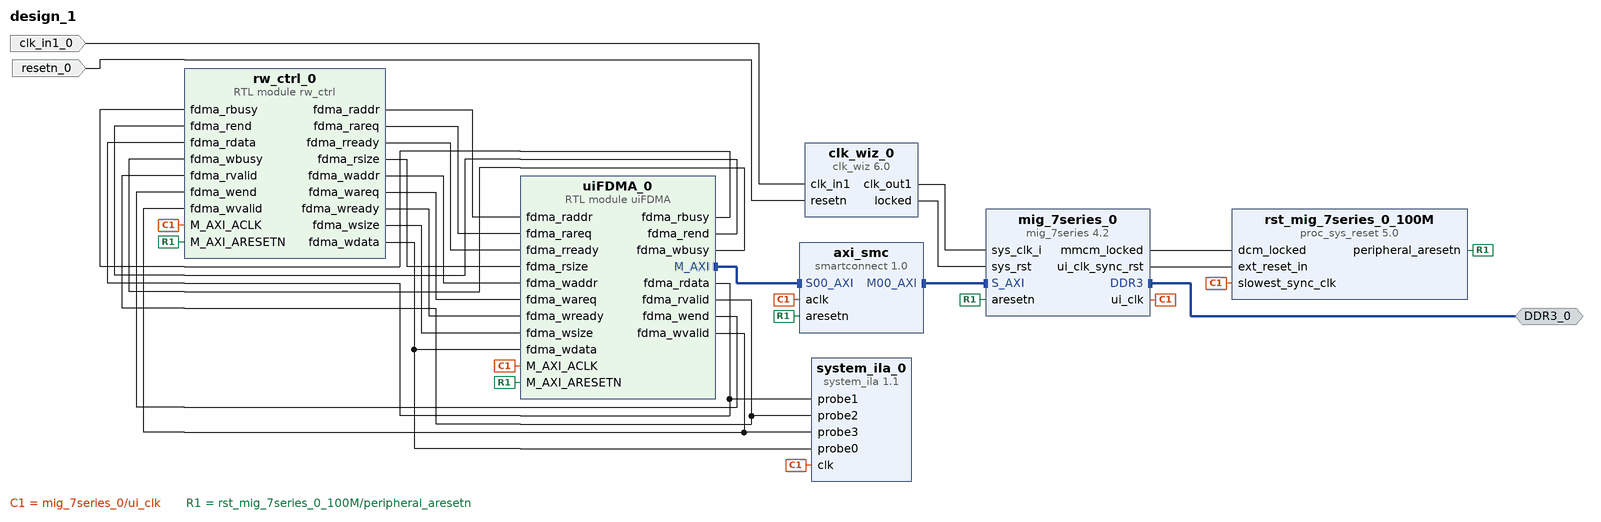
[diagram p0: block diagram of the top level]
# Vivado block design design_1, xc7a35tfgg484-1, Vivado 2021.2
create_bd_design design_1

create_bd_intf_port -mode Master -vlnv xilinx.com:interface:ddrx_rtl:1.0 DDR3_0
create_bd_port -dir I -type rst resetn_0
create_bd_port -dir I -type clk clk_in1_0
set_property -dict {CONFIG.FREQ_HZ 50000000} [get_bd_ports clk_in1_0]

create_bd_cell -type ip -vlnv xilinx.com:ip:mig_7series:4.2 mig_7series_0
set_property -dict [list \
  CONFIG.BOARD_MIG_PARAM Custom \
  CONFIG.MIG_DONT_TOUCH_PARAM Custom \
  CONFIG.RESET_BOARD_INTERFACE Custom \
  CONFIG.XML_INPUT_FILE mig_a.prj \
] [get_bd_cells mig_7series_0]
create_bd_cell -type ip -vlnv xilinx.com:ip:clk_wiz:6.0 clk_wiz_0
set_property -dict [list \
  CONFIG.CLKIN1_JITTER_PS 200.0 \
  CONFIG.CLKOUT1_JITTER 142.107 \
  CONFIG.CLKOUT1_PHASE_ERROR 164.985 \
  CONFIG.CLKOUT1_REQUESTED_OUT_FREQ 200.000 \
  CONFIG.MMCM_CLKFBOUT_MULT_F 20.000 \
  CONFIG.MMCM_CLKIN1_PERIOD 20.000 \
  CONFIG.MMCM_CLKIN2_PERIOD 10.0 \
  CONFIG.MMCM_CLKOUT0_DIVIDE_F 5.000 \
  CONFIG.PRIM_IN_FREQ 50.000 \
  CONFIG.RESET_PORT resetn \
  CONFIG.RESET_TYPE ACTIVE_LOW \
] [get_bd_cells clk_wiz_0]
create_bd_cell -type ip -vlnv xilinx.com:ip:smartconnect:1.0 axi_smc
set_property -dict {CONFIG.NUM_SI 1} [get_bd_cells axi_smc]
create_bd_cell -type ip -vlnv xilinx.com:ip:proc_sys_reset:5.0 rst_mig_7series_0_100M
create_bd_cell -type module -reference uiFDMA uiFDMA_0
create_bd_cell -type module -reference rw_ctrl rw_ctrl_0
create_bd_cell -type ip -vlnv xilinx.com:ip:system_ila:1.1 system_ila_0
set_property -dict [list \
  CONFIG.C_MON_TYPE NATIVE \
  CONFIG.C_NUM_OF_PROBES 4 \
  CONFIG.C_PROBE0_TYPE 0 \
  CONFIG.C_PROBE1_TYPE 0 \
  CONFIG.C_PROBE2_TYPE 0 \
  CONFIG.C_PROBE3_TYPE 0 \
] [get_bd_cells system_ila_0]

# ---- connections ----

connect_bd_intf_net [get_bd_intf_pins axi_smc/M00_AXI] [get_bd_intf_pins mig_7series_0/S_AXI]
connect_bd_intf_net [get_bd_intf_ports DDR3_0] [get_bd_intf_pins mig_7series_0/DDR3]
connect_bd_intf_net [get_bd_intf_pins uiFDMA_0/M_AXI] [get_bd_intf_pins axi_smc/S00_AXI]
connect_bd_net -net clk_in1_0_1 [get_bd_ports clk_in1_0] [get_bd_pins clk_wiz_0/clk_in1]
connect_bd_net [get_bd_pins clk_wiz_0/clk_out1] [get_bd_pins mig_7series_0/sys_clk_i]
connect_bd_net [get_bd_pins clk_wiz_0/locked] [get_bd_pins mig_7series_0/sys_rst]
connect_bd_net [get_bd_pins mig_7series_0/mmcm_locked] [get_bd_pins rst_mig_7series_0_100M/dcm_locked]
connect_bd_net [get_bd_pins mig_7series_0/ui_clk] \
  [get_bd_pins axi_smc/aclk] [get_bd_pins rst_mig_7series_0_100M/slowest_sync_clk] [get_bd_pins uiFDMA_0/M_AXI_ACLK] \
  [get_bd_pins rw_ctrl_0/M_AXI_ACLK] [get_bd_pins system_ila_0/clk]
connect_bd_net [get_bd_pins mig_7series_0/ui_clk_sync_rst] [get_bd_pins rst_mig_7series_0_100M/ext_reset_in]
connect_bd_net -net resetn_0_1 [get_bd_ports resetn_0] [get_bd_pins clk_wiz_0/resetn]
connect_bd_net [get_bd_pins rst_mig_7series_0_100M/peripheral_aresetn] \
  [get_bd_pins mig_7series_0/aresetn] [get_bd_pins axi_smc/aresetn] [get_bd_pins uiFDMA_0/M_AXI_ARESETN] \
  [get_bd_pins rw_ctrl_0/M_AXI_ARESETN]
connect_bd_net [get_bd_pins rw_ctrl_0/fdma_raddr] [get_bd_pins uiFDMA_0/fdma_raddr]
connect_bd_net [get_bd_pins rw_ctrl_0/fdma_rareq] [get_bd_pins uiFDMA_0/fdma_rareq]
connect_bd_net [get_bd_pins rw_ctrl_0/fdma_rready] [get_bd_pins uiFDMA_0/fdma_rready]
connect_bd_net [get_bd_pins rw_ctrl_0/fdma_rsize] [get_bd_pins uiFDMA_0/fdma_rsize]
connect_bd_net [get_bd_pins rw_ctrl_0/fdma_waddr] [get_bd_pins uiFDMA_0/fdma_waddr]
connect_bd_net [get_bd_pins rw_ctrl_0/fdma_wareq] [get_bd_pins uiFDMA_0/fdma_wareq]
connect_bd_net -net rw_ctrl_0_fdma_wdata [get_bd_pins rw_ctrl_0/fdma_wdata] [get_bd_pins uiFDMA_0/fdma_wdata] [get_bd_pins system_ila_0/probe0]
connect_bd_net [get_bd_pins rw_ctrl_0/fdma_wready] [get_bd_pins uiFDMA_0/fdma_wready]
connect_bd_net [get_bd_pins rw_ctrl_0/fdma_wsize] [get_bd_pins uiFDMA_0/fdma_wsize]
connect_bd_net [get_bd_pins uiFDMA_0/fdma_rbusy] [get_bd_pins rw_ctrl_0/fdma_rbusy]
connect_bd_net -net uiFDMA_0_fdma_rdata [get_bd_pins uiFDMA_0/fdma_rdata] [get_bd_pins rw_ctrl_0/fdma_rdata] [get_bd_pins system_ila_0/probe1]
connect_bd_net [get_bd_pins uiFDMA_0/fdma_rend] [get_bd_pins rw_ctrl_0/fdma_rend]
connect_bd_net -net uiFDMA_0_fdma_rvalid [get_bd_pins uiFDMA_0/fdma_rvalid] [get_bd_pins rw_ctrl_0/fdma_rvalid] [get_bd_pins system_ila_0/probe2]
connect_bd_net [get_bd_pins uiFDMA_0/fdma_wbusy] [get_bd_pins rw_ctrl_0/fdma_wbusy]
connect_bd_net [get_bd_pins uiFDMA_0/fdma_wend] [get_bd_pins rw_ctrl_0/fdma_wend]
connect_bd_net -net uiFDMA_0_fdma_wvalid [get_bd_pins uiFDMA_0/fdma_wvalid] [get_bd_pins rw_ctrl_0/fdma_wvalid] [get_bd_pins system_ila_0/probe3]
set_property HDL_ATTRIBUTE.DEBUG true [get_bd_nets rw_ctrl_0_fdma_wdata]
set_property HDL_ATTRIBUTE.MARK_DEBUG true [get_bd_nets rw_ctrl_0_fdma_wdata]
set_property HDL_ATTRIBUTE.DEBUG true [get_bd_nets uiFDMA_0_fdma_rdata]
set_property HDL_ATTRIBUTE.MARK_DEBUG true [get_bd_nets uiFDMA_0_fdma_rdata]
set_property HDL_ATTRIBUTE.DEBUG true [get_bd_nets uiFDMA_0_fdma_rvalid]
set_property HDL_ATTRIBUTE.MARK_DEBUG true [get_bd_nets uiFDMA_0_fdma_rvalid]
set_property HDL_ATTRIBUTE.DEBUG true [get_bd_nets uiFDMA_0_fdma_wvalid]
set_property HDL_ATTRIBUTE.MARK_DEBUG true [get_bd_nets uiFDMA_0_fdma_wvalid]

# ---- address map ----
assign_bd_address -offset 0x80000000 -range 256M -target_address_space [get_bd_addr_spaces uiFDMA_0/M_AXI] [get_bd_addr_segs mig_7series_0/memmap/memaddr]

validate_bd_design
save_bd_design
